# EAGLE design master_m8_2 (EAGLE 5.09)
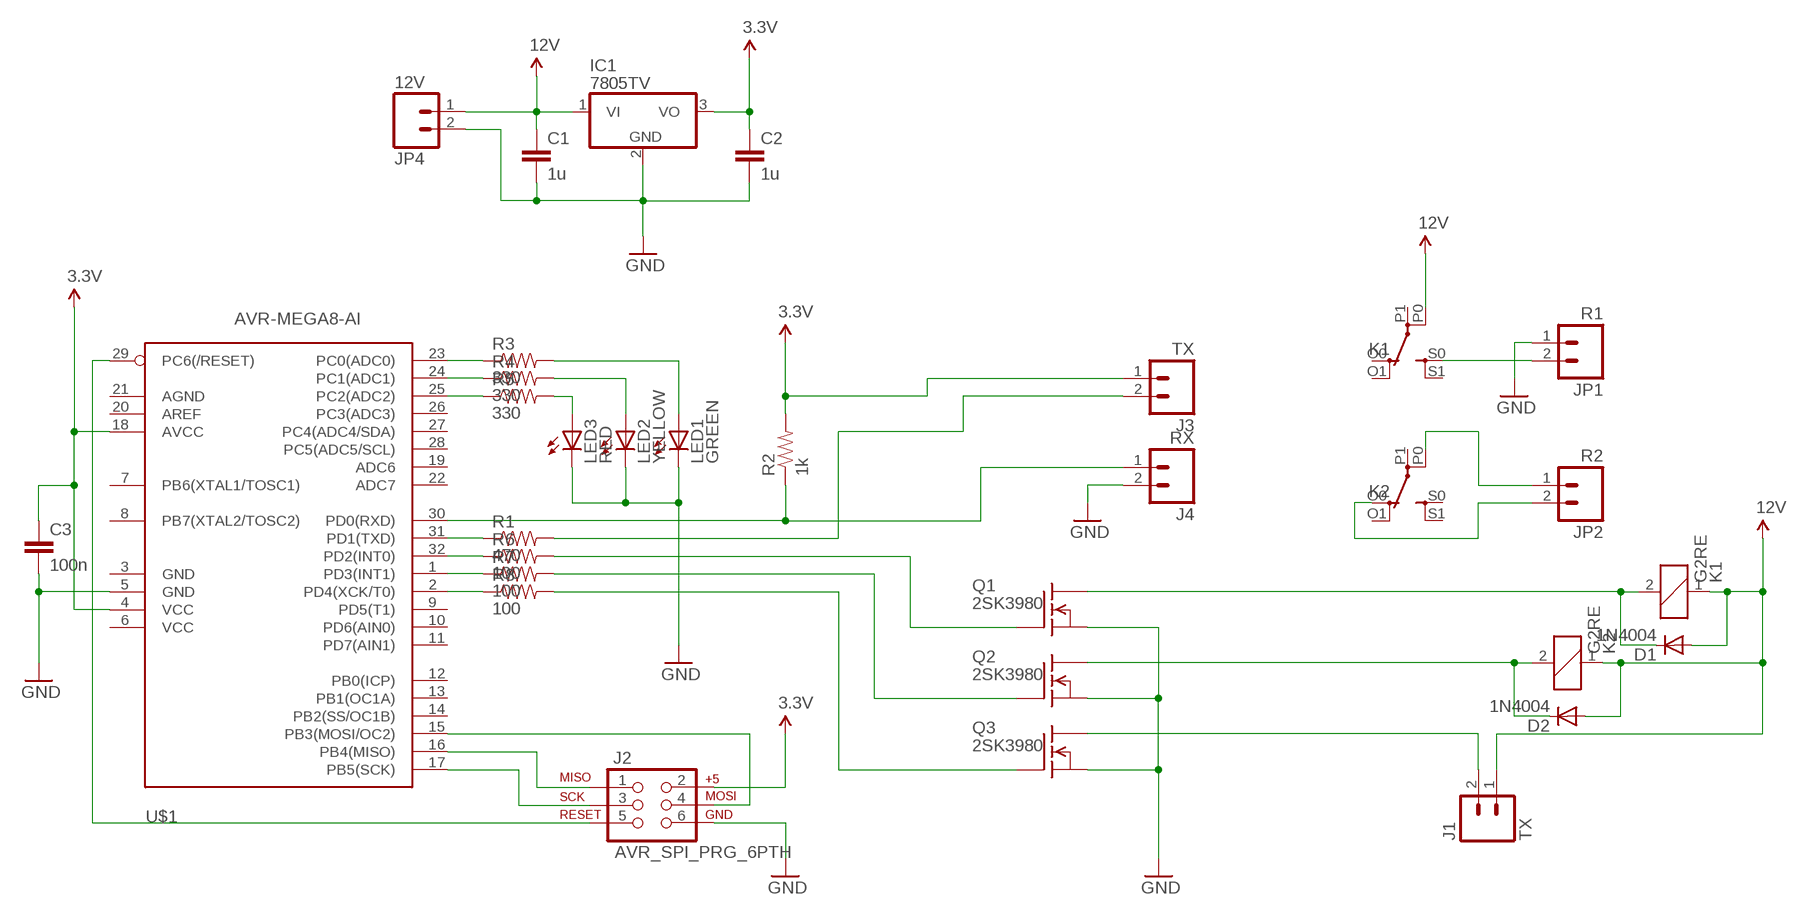
[diagram p0: schematic, sheet 1]

## Parts
C1  1u  CAPPTH1  [CAP-PTH-5MM]
C2  1u  CAPPTH1  [CAP-PTH-5MM]
C3  100n  CAP0805  [0805]
D1  1N4004  DIODESMA  [SMA-DIODE]
D2  1N4004  DIODESMA  [SMA-DIODE]
IC1  7805TV  [TO220V]
J1  TX  M02  [1X02_LONGPADS]
J2  AVR_SPI_PRG_6PTH  [2X3]
J3  TX  M02  [1X02_LONGPADS]
J4  RX  M02  [1X02_LONGPADS]
JP1  R1  M025MM  [SCREWTERMINAL-5MM-2]
JP2  R2  M025MM  [SCREWTERMINAL-5MM-2]
JP4  12V  M025MM  [SCREWTERMINAL-5MM-2]
K1  G2RE  [G2RE]
K2  G2RE  [G2RE]
LED1  GREEN  LED3MM  [LED3MM]
LED2  YELLOW  LED3MM  [LED3MM]
LED3  RED  LED3MM  [LED3MM]
Q1  2SK3980  [SOT89]
Q2  2SK3980  [SOT89]
Q3  2SK3980  [SOT89]
R1  470  RESISTOR  [0805]
R2  1k  RESISTOR  [0805]
R3  330  RESISTOR  [0805]
R4  330  RESISTOR  [0805]
R5  330  RESISTOR  [0805]
R6  100  RESISTOR  [0805]
R7  100  RESISTOR  [0805]
R8  100  RESISTOR  [0805]
U$1  AVR-MEGA8-AI  [TQFP32-08]

## Nets
3.3V: C2.1 C3.1 IC1.3(VO) J2.2 J3.1 R2.2 U$1.4(VCC) U$1.18(AVCC)
5V: C1.1 D1.A D2.A IC1.1(VI) J1.1 JP4.1 K1.1 K1.P0(2:P) K2.1 ; supply symbol labelled 12V
GND: C1.2 C2.2 C3.2 IC1.2(GND) J2.6 J4.2 JP1.1 JP4.2 LED1.K(C) LED2.K(C) LED3.K(C) Q1.3(S) Q2.3(S) Q3.3(S) U$1.5(GND)
N$1: JP2.2 K2.O0(2:O)
N$2: J2.5 U$1.29(PC6(/RESET))
N$3: J2.3 U$1.17(PB5(SCK))
N$4: J2.1 U$1.16(PB4(MISO))
N$5: J2.4 U$1.15(PB3(MOSI/OC2))
N$6: R1.1 U$1.31(PD1(TXD))
N$7: J3.2 R1.2
N$8: J4.1 R2.1 U$1.30(PD0(RXD))
N$11: R3.1 U$1.23(PC0(ADC0))
N$12: R4.1 U$1.24(PC1(ADC1))
N$13: R5.1 U$1.25(PC2(ADC2))
N$14: R6.1 U$1.32(PD2(INT0))
N$15: R7.1 U$1.1(PD3(INT1))
N$16: R8.1 U$1.2(PD4(XCK/T0))
N$17: LED3.A R5.2
N$18: LED2.A R4.2
N$19: LED1.A R3.2
N$20: Q1.1(G) R6.2
N$21: Q2.1(G) R7.2
N$22: Q3.1(G) R8.2
N$23: JP1.2 K1.S0(2:S)
N$25: JP2.1 K2.P0(2:P)
N$26: J1.2 Q3.2(D)
N$27: D2.C K2.2 Q2.2(D)
N$28: D1.C K1.2 Q1.2(D)
Unconnected: K1.O0(2:O) K1.O1(2:O) K1.P1(2:P) K1.S1(2:S) K2.O1(2:O) K2.P1(2:P) K2.S0(2:S) K2.S1(2:S) U$1.3(GND) U$1.6(VCC) U$1.7(PB6(XTAL1/TOSC1)) U$1.8(PB7(XTAL2/TOSC2)) U$1.9(PD5(T1)) U$1.10(PD6(AIN0)) U$1.11(PD7(AIN1)) U$1.12(PB0(ICP)) U$1.13(PB1(OC1A)) U$1.14(PB2(SS/OC1B)) U$1.19(ADC6) U$1.20(AREF) U$1.21(AGND) U$1.22(ADC7) U$1.26(PC3(ADC3)) U$1.27(PC4(ADC4/SDA)) U$1.28(PC5(ADC5/SCL))

## Library data of the parts
C1-C3 = SparkFun:CAP: Capacitor Standard 0603 ceramic capacitor, and 0.1" leaded capacitor.
D1 D2 = SparkFun:DIODE: Diode These are standard reverse protection diodes and small signal diodes. SMA package can handle up to about 1A. SOD-323 can handle about 200mA. What the SOD-323 package when ordering, there are some mfgs out there that are 5-pin packages.
IC1 = linear:78*: Positive VOLTAGE REGULATOR Source: http://cache.national.com/ds/LM/LM78L05.pdf http://www.fairchildsemi.com/ds/LM/LM7805.pdf
J1 J3 J4 JP1 JP2 JP4 = SparkFun:M02: Header 2 Standard 2-pin 0.1" header. Use with straight break away headers (SKU : PRT-00116), right angle break away headers (PRT-00553), swiss pins (PRT-00743), machine pins (PRT-00117), and female headers (PRT-00115). Molex polarized connector foot print use with SKU : PRT-08233 with associated crimp pins and housings.
J2 = SparkFun:AVR_SPI_PRG_6: AVR ISP 6 Pin This is the reduced ISP connector for AVR programming. Common on Arduino. This footprint will take up less PCB space and can be used with a 10-pin to 6-pin adapter such as SKU: BOB-08508
K1 K2 = relay:G2RE: RELAY 1 x switch, high current, Omron
LED1-LED3 = SparkFun:LED: LEDs Standard schematic elements and footprints for 5mm, 3mm, 1206, and 0603 sized LEDs. 5mm - Spark Fun Electronics SKU : COM-00529 (and others)
Q1-Q3 = kng:2SK3980: N-Channel Enhancement MOSFET 20V; 1A; 0,35Ohm
R1-R8 = SparkFun:RESISTOR: Resistor Basic schematic elements and footprints for 0603, 1206, and PTH 1/10th watt (small) resistors.
U$1 = SparkFun:AVR-MEGA8: MICROCONTROLLER 8 Kbytes FLASH 1 kbytes SRAM 512 bytes EEPROM USART 6-channel 10 bit ADC 2-channel 8 bit ADC

## Board
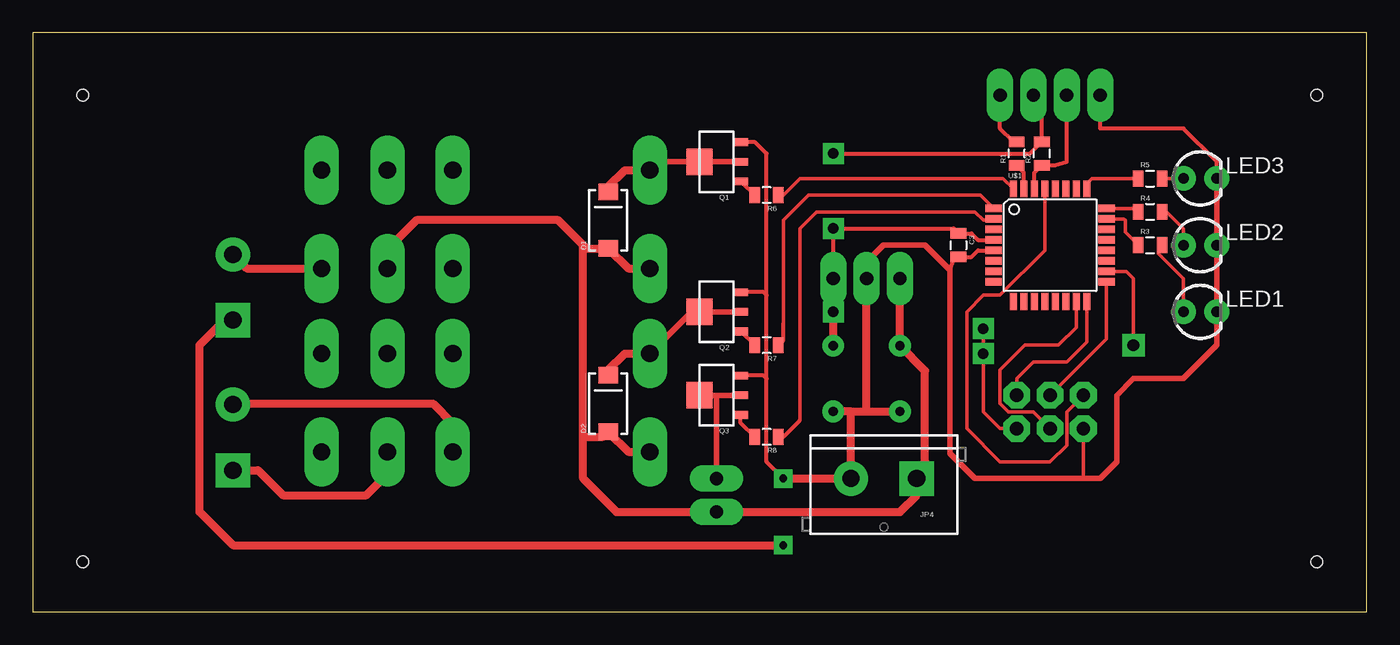
[diagram p1: board, top side]
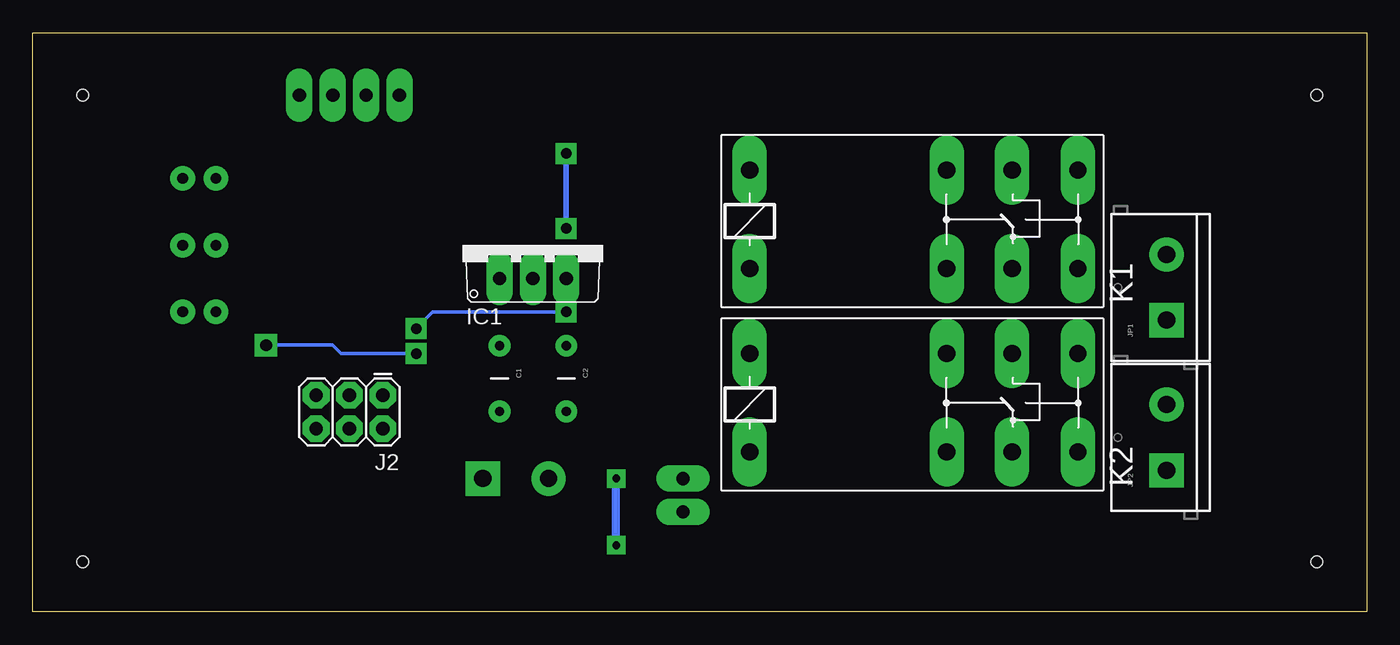
[diagram p2: board, bottom side, seen from below]

Size 101.58 x 44.12 mm. Coordinates in mm from the lower left corner, seen from the top.
Outline: 0,0 101.58,0 101.58,44.12 0,44.12 0,0
Copper layers (1*16): Top 0.035mm / dielectric 1.5mm / Bottom 0.035mm
Design rules "kng": minimum track width 0.25mm, minimum drill 0.8mm, track to track 0.2mm, track to pad 0.2mm, pad to pad 0.2mm, via to via 0.2mm, smd to smd 0.2mm, copper to edge 1mm, drill to drill 0.2mm, minimum pad ring 0.4mm, minimum via ring 0.4mm, stop-mask expansion 0.15mm, vias tented up to drill 0mil, thermal gap 0.25mm
Holes 0.9 mm at 97.79,3.81 97.79,39.37 3.81,39.37 3.81,3.81

### Footprints (pad centres in the part's own frame; a part is rotated, then mirrored left to right if it is on the bottom)
CAP-PTH-5MM = drill 0.7 pad 1.651 round: 1 -2.5,0; 2 2.5,0
0805 = smd 0.8 x 1.2: 1 -0.9,0; 2 0.9,0
SMA-DIODE = smd 1.27 x 1.47: A -2.15,0; C 2.15,0
TO220V = drill 1.016 long: 1 -2.54,-2.54; 2 0,-2.54; 3 2.54,-2.54
1X02_LONGPADS = drill 1.016 pad 1.88 long: 1 0,0; 2 2.54,0
2X3 = drill 1.016 pad 1.88 octagon: 1 0,0; 2 0,2.54; 3 2.54,0; 4 2.54,2.54; 5 5.08,0; 6 5.08,2.54
SCREWTERMINAL-5MM-2 = drill 1.3 pad 2.032 square: 1 0,0 | drill 1.3 pad 2.032 round: 2 5,0
G2RE = drill 1.321 long: 1 -2.54,-3.683; 2 -2.54,3.81; O0 12.471,-3.683; O1 12.471,3.81; P0 17.45,-3.683; P1 17.45,3.81; S0 22.454,-3.683; S1 22.454,3.81
LED3MM = drill 0.813 pad 1.88 round: A -1.27,0; K 1.27,0
SOT89 = smd 0.58 x 1.2: 1 -1.5,-1.8; 2 0,-1.8; 3 1.5,-1.8 | smd 2 x 2: 4 0,1.3
TQFP32-08 = smd 1.27 x 0.559: 1 -4.293,2.8; 2 -4.293,2; 3 -4.293,1.2; 4 -4.293,0.4; 5 -4.293,-0.4; 6 -4.293,-1.2; 7 -4.293,-2; 8 -4.293,-2.8; 17 4.293,-2.8; 18 4.293,-2; 19 4.293,-1.2; 20 4.293,-0.4; 21 4.293,0.4; 22 4.293,1.2; 23 4.293,2; 24 4.293,2.8 | smd 0.559 x 1.27: 9 -2.8,-4.293; 10 -2,-4.293; 11 -1.2,-4.293; 12 -0.4,-4.293; 13 0.4,-4.293; 14 1.2,-4.293; 15 2,-4.293; 16 2.8,-4.293; 25 2.8,4.293; 26 2,4.293; 27 1.2,4.293; 28 0.4,4.293; 29 -0.4,4.293; 30 -1.2,4.293; 31 -2,4.293; 32 -2.8,4.293

### Placement (x,y rotation side)
C1  66.04,17.78 270 bottom
C2  60.96,17.78 270 bottom
C3  70.48,27.94 270 top
D1  43.81,29.84 90 top
D2  43.81,15.88 90 top
IC1  63.5,27.94 0 bottom
J1  52.07,7.62 90 top
J2  74.93,16.51 180 bottom
J3  76.2,39.37 0 bottom
J4  78.74,39.37 180 bottom
JP1  15.24,22.23 90 bottom
JP2  15.24,10.79 90 bottom
JP4  67.31,10.16 180 top
K1  44.45,29.84 0 bottom
K2  44.45,15.88 0 bottom
LED1  88.9,22.86 0 top
LED2  88.9,27.94 0 top
LED3  88.9,33.02 0 top
Q1  52.07,34.29 90 top
Q2  52.07,22.86 90 top
Q3  52.07,16.51 90 top
R1  74.93,34.92 90 top
R2  76.83,34.92 90 top
R3  85.09,27.94 0 top
R4  85.09,30.48 0 top
R5  85.09,33.02 0 top
R6  55.88,31.75 180 top
R7  55.88,20.32 180 top
R8  55.88,13.34 180 top
U$1  77.47,27.94 0 top

### Tracks (layer width: path | path; a pad name or v marks a point on that pad's centre or on a via)
3.3V  (via drill 0.8, 0.9)
  Top 0.254: J2.2 73.66,13.97 72.39,15.24 v72.39,21.59 v72.39,19.68 | U$1.18 83.28,25.94 83.82,25.4 v83.82,20.32
  Top 0.305: IC1.3 v60.96,29.21 70.11,29.21 C3.1 71.49,28.84 71.99,28.34 U$1.4 | v60.96,34.92 75.94,34.92 R2.2 76.83,38.73 J3.1
  Top 0.61: C2.1 v60.96,22.86 IC1.3
  Bottom 0.254: v72.39,19.68 78.11,19.68 78.74,20.32 v83.82,20.32 | v72.39,21.59 71.12,22.86 v60.96,22.86
  Bottom 0.406: v60.96,29.21 v60.96,34.92
5V
  Top 0.61: IC1.1 C1.1 67.94,18.38 67.94,11.43 67.31,10.79 JP4.1 67.31,8.89 66.04,7.62 J1.1 44.45,7.62 41.91,10.16 41.91,13.34 | K2.1 45.35,12.19 D2.A 43.42,13.34 41.91,13.34 | K1.1 45.35,26.16 D1.A 42.16,27.7 41.91,27.94 | 41.91,13.34 41.91,27.94 | 41.91,27.94 40.01,29.84 29.21,29.84 27.3,27.94 27.3,26.47 K1.P0
GND  (via drill 0.6)
  Top 0.254: 80.01,10.16 J2.6
  Top 0.305: 60.92,15.24 60.96,15.24 | U$1.5 71.99,27.54 71.49,27.04 C3.2 70.22,27.04 69.85,26.04 | 55.88,17.78 55.88,11.43 v57.15,10.16 | 55.88,17.78 55.88,24.13 | LED3.K 90.17,34.29 87.63,36.83 81.28,36.83 J4.2 | Q2.3 55.65,24.36 55.88,24.13 | Q3.3 55.65,18.01 55.88,17.78 | 55.88,24.13 55.88,34.92 55.02,35.79 Q1.3
  Top 0.406: IC1.2 63.5,26.67 64.77,27.94 67.94,27.94 69.85,26.04 69.85,12.06 71.75,10.16 80.01,10.16 81.28,10.16 82.55,11.43 82.55,16.51 83.82,17.78 87.63,17.78 90.17,20.32 LED1.K LED2.K LED3.K
  Top 0.61: 63.5,15.24 IC1.2 | 62.23,15.28 C2.2 60.92,15.24 | 62.23,15.28 63.46,15.28 63.5,15.24 | C1.2 63.54,15.28 63.5,15.24 | 62.23,15.28 62.31,15.2 JP4.2 v57.15,10.16 | v57.15,5.08 15.24,5.08 12.7,7.62 12.7,20.32 14.61,22.23 JP1.1
  Bottom 0.61: v57.15,5.08 v57.15,10.16
N$1
  Top 0.61: K2.O0 31.98,14.38 30.48,15.88 15.32,15.88 JP2.2
N$2
  Top 0.254: U$1.29 77.07,27.54 73.66,24.13 72.39,24.13 71.12,22.86 71.12,13.97 73.66,11.43 77.47,11.43 78.74,12.7 78.74,15.24 J2.5
N$3
  Top 0.254: U$1.17 81.76,20.8 J2.3
N$4
  Top 0.254: J2.1 74.93,17.78 76.2,19.05 78.74,19.05 80.27,20.58 U$1.16
N$5
  Top 0.254: J2.4 76.2,15.24 74.3,15.24 73.66,15.88 73.66,18.41 75.56,20.32 78.11,20.32 79.47,21.68 U$1.15
N$6
  Top 0.305: U$1.31 75.47,33.48 R1.1
N$7
  Top 0.305: R1.2 74.67,35.83 73.66,36.83 J3.2
N$8
  Top 0.305: U$1.30 76.27,33.46 R2.1 77.84,34.02 78.74,34.29 J4.1
N$11
  Top 0.254: U$1.23 83.09,29.94 83.19,29.84 83.19,28.95 R3.1
N$12
  Top 0.254: U$1.24 83.93,30.74 R4.1
N$13
  Top 0.254: U$1.25 80.27,32.65 80.64,33.02 R5.1
N$14
  Top 0.254: U$1.32 73.88,33.02 58.42,33.02 57.15,31.75 R6.1
N$15
  Top 0.254: U$1.1 72.17,31.75 59.05,31.75 57.15,29.84 57.15,21.96
  Top 0.305: 57.15,21.96 57.15,20.69 R7.1
N$16
  Top 0.254: 58.42,14.61 58.42,29.21 59.69,30.48 71.75,30.48 72.39,29.84 73.08,29.84
  Top 0.305: 73.08,29.84 U$1.2 | 58.42,14.61 57.15,13.34 R8.1
N$17
  Top 0.254: R5.2 LED3.A
N$18
  Top 0.254: LED2.A 87.63,29.21 86.36,30.48 R4.2
N$19
  Top 0.254: LED1.A 87.63,25.4 85.72,27.3 85.72,27.68 R3.2
N$20
  Top 0.305: Q1.1 53.94,32.79 R6.2
N$21
  Top 0.305: Q2.1 53.87,21.43 R7.2
N$22
  Top 0.305: Q3.1 53.87,14.45 R8.2
N$23
  Top 0.61: K1.S0 16.3,26.16 JP1.2
N$25
  Top 0.61: JP2.1 17.14,10.79 19.05,8.89 25.4,8.89 26.67,10.16 26.67,11.86 K2.P0
N$26
  Top 0.406: Q3.2 52.07,16.51 | 50.8,16.51 52.07,16.51 | 52.07,16.51 J1.2
N$27
  Top 0.406: Q2.2 50.16,22.86 K2.2
  Top 0.61: D2.C 43.81,18.41 45.09,19.68 K2.2
N$28
  Top 0.406: Q1.2 47.62,34.29 K1.2
  Top 0.61: D1.C 43.81,32.38 45.09,33.66 K1.2